# Altium schematic sheet CON1.SchDoc
size A4; SheetNumber: 1; SheetTotal: 6
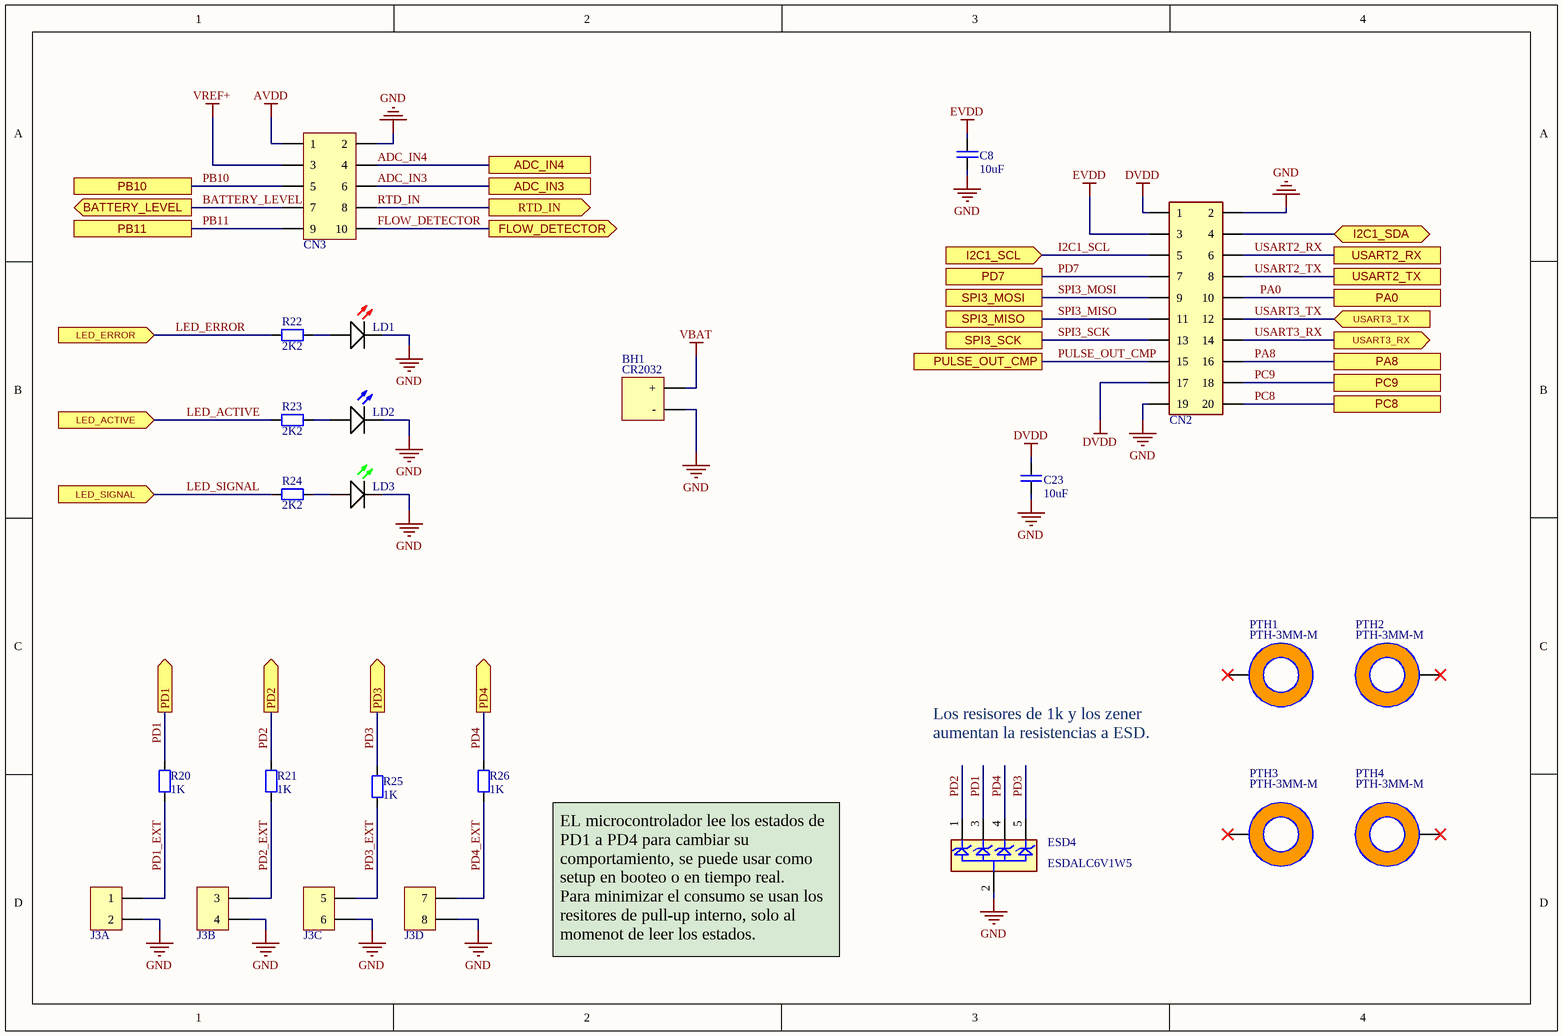
[diagram p0: CON1.SchDoc]

## Parts
BH1  CR2032  [BS-08-B2AA016]
C8  10uF  [CAP_SM0805_YAGEOCC2_N]
C23  10uF  [CAP_SM0805_YAGEOCC2_N]
CN2  DW254R-22-20-85  [DW254R-22-10-85]  (value not drawn)
CN3  DW254S-22-10-85  [2X5 100 MILS SMD]  (value not drawn)
ESD4  ESDALC6V1W5  [ESDALC6V1W5]
J3  PH2.54-07-04PWS-JUMPER  [HEADER PIN 2X4 A 90 GRADOS]  (value not drawn)  (parts A,B,C,D of 4)
LD1  ERROR  [LED 0805]  (value not drawn)
LD2  RUN  [LED 0805]  (value not drawn)
LD3  SGINAL  [LED 0805]  (value not drawn)
PTH1  PTH-3MM-M  [PTH_M3_M]  (no BOM)
PTH2  PTH-3MM-M  [PTH_M3_M]  (no BOM)
PTH3  PTH-3MM-M  [PTH_M3_M]  (no BOM)
PTH4  PTH-3MM-M  [PTH_M3_M]  (no BOM)
R20  1K  [RES_SM0805_YAGEORC_N]
R21  1K  [RES_SM0805_YAGEORC_N]
R22  2K2  [RES_SM0805_YAGEORC_N]
R23  2K2  [RES_SM0805_YAGEORC_N]
R24  2K2  [RES_SM0805_YAGEORC_N]
R25  1K  [RES_SM0805_YAGEORC_N]
R26  1K  [RES_SM0805_YAGEORC_N]

## Ports
ADC_IN3, ADC_IN4, BATTERY_LEVEL (out), FLOW_DETECTOR (out), I2C1_SCL (in), I2C1_SDA (bidir), LED_ACTIVE (in), LED_ERROR (in), LED_SIGNAL (in), PA0, PA8, PB10, PB11, PC8, PC9, PD1 (out), PD2 (out), PD3 (out), PD4 (out), PD7, PULSE_OUT_CMP, RTD_IN (out), SPI3_MISO, SPI3_MOSI, SPI3_SCK, USART2_RX, USART2_TX, USART3_RX (out), USART3_TX (in)

## Nets
AVDD: CN3.1
DVDD: C23.2 CN2.1 CN2.17
EVDD: C8.2 CN2.3
GND: BH1.NEG(-) C8.1 C23.1 CN2.2 CN2.19 CN3.2 ESD4.2(GND) J3.2 J3.4 J3.6 J3.8 LD1.K LD2.K LD3.K
VBAT: BH1.POS(+)
VREF+: CN3.3
ADC_IN3: CN3.6 ; port ADC_IN3
ADC_IN4: CN3.4 ; port ADC_IN4
BATTERY_LEVEL: CN3.7 ; port BATTERY_LEVEL
FLOW_DETECTOR: CN3.10 ; port FLOW_DETECTOR
I2C1_SCL: CN2.5 ; port I2C1_SCL
I2C1_SDA: CN2.4 ; port I2C1_SDA
LED_ACTIVE: R23.1 ; port LED_ACTIVE
LED_ERROR: R22.1 ; port LED_ERROR
LED_SIGNAL: R24.1 ; port LED_SIGNAL
PA0: CN2.10 ; port PA0
PA8: CN2.16 ; port PA8
PB10: CN3.5 ; port PB10
PB11: CN3.9 ; port PB11
PC8: CN2.20 ; port PC8
PC9: CN2.18 ; port PC9
PD1: ESD4.3(I/02) R20.2 ; port PD1
PD1_EXT: J3.1 R20.1
PD2: ESD4.1(I/01) R21.2 ; port PD2
PD2_EXT: J3.3 R21.1
PD3: ESD4.5(I/04) R25.2 ; port PD3
PD3_EXT: J3.5 R25.1
PD4: ESD4.4(I/03) R26.2 ; port PD4
PD4_EXT: J3.7 R26.1
PD7: CN2.7 ; port PD7
PULSE_OUT_CMP: CN2.15 ; port PULSE_OUT_CMP
RTD_IN: CN3.8 ; port RTD_IN
SPI3_MISO: CN2.11 ; port SPI3_MISO
SPI3_MOSI: CN2.9 ; port SPI3_MOSI
SPI3_SCK: CN2.13 ; port SPI3_SCK
USART2_RX: CN2.6 ; port USART2_RX
USART2_TX: CN2.8 ; port USART2_TX
USART3_RX: CN2.14 ; port USART3_RX
USART3_TX: CN2.12 ; port USART3_TX
NetLD1_A: LD1.A R22.2
NetLD2_A: LD2.A R23.2
NetLD3_A: LD3.A R24.2

Not connected (* = marked no-connect by the designer): PTH1 1*; PTH2 1*; PTH3 1*; PTH4 1*

## Notes on the sheet
- Los resisores de 1k y los zener aumentan la resistencias a ESD.
- EL microcontrolador lee los estados de PD1 a PD4 para cambiar su comportamiento, se puede usar como setup en booteo o en tiempo real.
  Para minimizar el consumo se usan los resitores de pull-up interno, solo al momenot de leer los estados.
- Title:
- Size: A4
- Date:
- Sheet:
- Time:
- Of:
- Version:
- Revision:
- Release:
- FLOWMEET SRL
- File

## Library data of the parts
BH1 = BS-08-B2AA016: Battery base -25℃~+85℃ CR2032 SMD Battery Connectors ROHS; Manufacturer: Myoung; Manufacturer part number: BS-08-B2AA016; Category: Battery holder; Datasheet: https://datasheet.lcsc.com/lcsc/2012181809_MYOUNG-BS-08-B2AA016_C964792.pdf; Temperature Max: 85; Temperature Min: -25
C8 C23 = CC0805KKX5R8BB106: CAP 10uF SM0805 X5R 25V YAGEO; Tolerance: 10; Category: Capacitor; Manufacturer: Yageo; Manufacturer Part Number: CC0805KKX5R8BB106; Package: 0805; Value: 10uF; ComponentLink1Description: Manufacturer Website; ComponentLink1URL: http://www.yageo.com; Datasheet: https://datasheet.lcsc.com/lcsc/2304140030_YAGEO-CC0805KKX5R8BB106_C89831.pdf
CN2 = DW254R-22-20-85: 2 x 10 - true hole 2.54mm - altura 8.5mm; Manufacturer: Dealon; Category: Header female; Manufacturer Part Number: DW254R-22-20-85; Main supplier: LCSC
CN3 = DW254S-22-10-85: 2 x 5 - SMD 2.54mm - altura 8.5mm; Manufacturer: Dealon; Category: Header female; Manufacturer Part Number: DW254S-22-10-85; Main supplier: LCSC
ESD4 = ESDALC6V1W5: TVS Diode Array Uni-Directional 6.1V / QTY 5 per pack, SOT-323 / Ranking 5: / Marca reconocida. / Usado en placas nucleo, sometidas a manipuleo nunca note un pin quemado por ESD.; Manufacturer: ST; Manufacturer Part Number: ESDALC6V1W5; Category: Diodo; Datasheet: https://www.st.com/content/ccc/resource/technical/document/datasheet/32/30/02/e6/ac/0f/46/c2/CD00002946.pdf/files/CD00002946.pdf/jcr:content/translations/en.CD00002946.pdf; Temperature Max: 150; Temperature Min: -40
J3 = PH2.54-07-04PWS-JUMPER: 2 x 4 - true hole  2.54mm 90°; Manufacturer: XUNPU; Manufacturer Part Number: PH2.54-07-04PWS; Category: Header pin
LD1 = 17-21SURC/S530-A2/TR8: Manufacturer: Everlight Elec; Manufacturer Part Number: 17-21SURC/S530-A2/TR8; Category: LED; Main supplier: LCSC
LD2 = 17-21/BHC-XL2M2TY/3T: Manufacturer: Everlight Elec; Manufacturer Part Number: 17-21/BHC-XL2M2TY; Category: LED; Datasheet: https://datasheet.lcsc.com/lcsc/1809192317_Everlight-Elec-17-21-BHC-XL2M2TY-3T_C72035.pdf; Temperature Max: 85; Temperature Min: -40; Main supplier: LCSC
LD3 = 17-21SYGC/S530-E2/TR8: Manufacturer: Everlight Elec; Manufacturer Part Number: 17-21SYGC/S530-E2/TR8; Category: LED; Datasheet: https://mm.digikey.com/Volume0/opasdata/d220001/medias/docus/559/17-21SYGC,S530-E2,TR8.pdf; Temperature Max: 85; Temperature Min: -40; Main supplier: LCSC
PTH1-PTH4 = PTH-3MM-M: Agujero de montaje metalizado roscas M3. Drill de tamaño medio.; Category: Mounting Hole; Temperature Max: -; Temperature Min: -
R20 R21 R25 R26 = RC0805FR-071KL: RES 1K SM0805 YAGEO RC_L; Power (Watts): 0.125; Resistance (Ohms): 1000; Tolerance (%): 1; Category: Resistor; Manufacturer: Yageo; Manufacturer Part Number: RC0805FR-071KL; Package: 0805; Value: 1K; Supplier Part Number 1: 9237496; Supplier 1: Farnell; ComponentLink1URL: http://www.yageo.com; ComponentLink1Description: Manufacturer Website; Supplier 2: Digi-Key; Supplier Part Number 2: 311-1.00KCRCT-ND; Datasheet: https://www.yageo.com/upload/media/product/app/datasheet/rchip/pyu-rc_group_51_rohs_l.pdf
R22-R24 = RC0805FR-072K2L: RES 2K2 SM0805 YAGEO RC_L; Power (Watts): 0.125; Resistance (Ohms): 2200; Tolerance (%): 1; Category: Resistor; Manufacturer: Yageo; Manufacturer Part Number: RC0805FR-072K2L; Package: 0805; Value: 2K2; Supplier Part Number 1: 9237534; Supplier 1: Farnell; ComponentLink1Description: Manufacturer Website; ComponentLink1URL: http://www.yageo.com; Supplier 2: Digi-Key; Supplier Part Number 2: 311-2.20KCRCT-ND